# EAGLE schematic Hifi Nutube DAC (EAGLE 9.6.2)
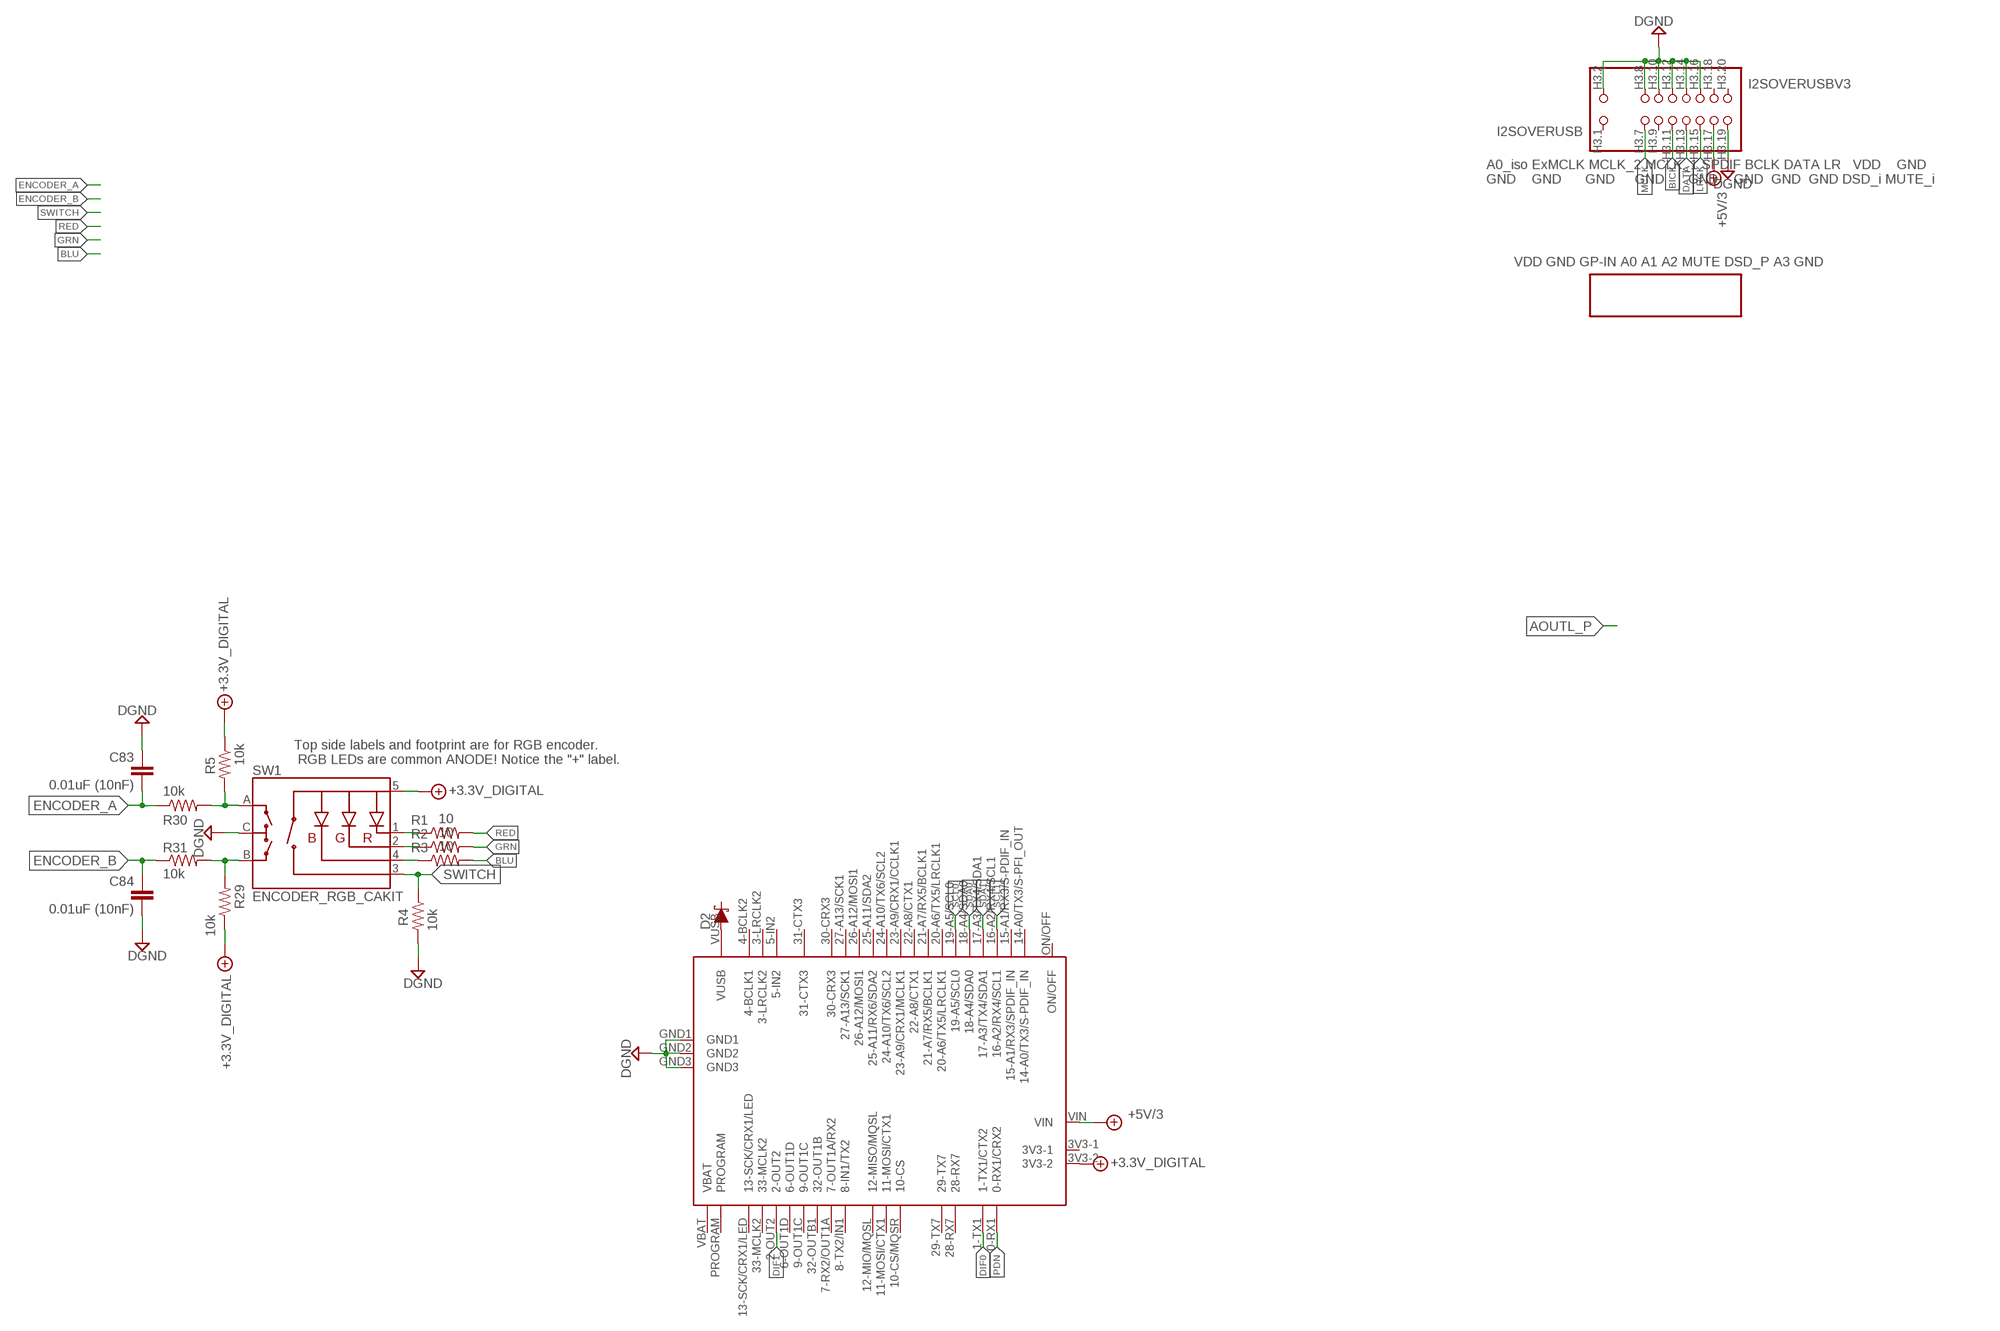
[diagram p0: schematic, sheet 1]

## Parts
C83  0.01uF (10nF)  C_885012206014_0603  [C0603]
C84  0.01uF (10nF)  C_885012206014_0603  [C0603]
D2  SS14-DIODE-SCHOTTKY-SS14  [SMA-DIODE]
I2SOVERUSB  I2SOVERUSBV3  [I2SOVERUSBV3]
R1  10  R_RC0603FR-7W10RL_0603  [R0603]
R2  10  R_RC0603FR-7W10RL_0603  [R0603]
R3  10  R_RC0603FR-7W10RL_0603  [R0603]
R4  10k  R_CMP0603AFX-1002ELF_0603  [R0603]
R5  10k  R_CMP0603AFX-1002ELF_0603  [R0603]
R29  10k  R_CMP0603AFX-1002ELF_0603  [R0603]
R30  10k  R_CMP0603AFX-1002ELF_0603  [R0603]
R31  10k  R_CMP0603AFX-1002ELF_0603  [R0603]
SW1  ENCODER_RGB_CAKIT  [ENCODER_LED_3_KIT]
U$4  TEENSY40  [TEENSY40]

## Nets
+3.3V_DIGITAL [Power]: R5.1 R29.1 SW1.5(+) U$4.3V3-2
+5V/3: I2SOVERUSB.H3.17 U$4.VIN
BICK: I2SOVERUSB.H3.11
BLU: R3.2
DATA: I2SOVERUSB.H3.13
DGND [Power]: C83.1 C84.2 I2SOVERUSB.H3.2 I2SOVERUSB.H3.8 I2SOVERUSB.H3.10 I2SOVERUSB.H3.12 I2SOVERUSB.H3.14 I2SOVERUSB.H3.16 I2SOVERUSB.H3.19 R4.2 SW1.C U$4.GND1 U$4.GND2 U$4.GND3
DIF0: U$4.1-TX1(1-TX1/CTX2)
DIF1: U$4.2-OUT2
ENCODER_A: C83.2 R30.1
ENCODER_B: C84.1 R31.1
GRN: R2.2
LRCK: I2SOVERUSB.H3.15
MCLK: I2SOVERUSB.H3.7
N$1: R1.1 SW1.1(-R)
N$4: R2.1 SW1.2(-G)
N$7: R3.1 SW1.4(-B)
N$9: R29.2 R31.2 SW1.B
N$10: R5.2 R30.2 SW1.A
N$14: D2.A U$4.VUSB
PDN: U$4.0-RX1(0-RX1/CRX2)
RED: R1.2
SCL0: U$4.19-A5/SCL0
SCL1: U$4.16-A2/RX4/SCL1
SDA0: U$4.18-A4/SDA0
SDA1: U$4.17-A3/TX4/SDA1
SWITCH: R4.1 SW1.3(SW)
Unconnected: D2.C I2SOVERUSB.H3.1 I2SOVERUSB.H3.9 I2SOVERUSB.H3.18 I2SOVERUSB.H3.20 U$4.3-LRCLK2 U$4.3V3-1 U$4.4-BCLK2(4-BCLK1) U$4.5-IN2 U$4.6-OUT1D U$4.7-RX2/OUT1A(7-OUT1A/RX2) U$4.8-TX2/IN1(8-IN1/TX2) U$4.9-OUT1C U$4.10-CS/MQSR(10-CS) U$4.11-MOSI/CTX1 U$4.12-MIO/MQSL(12-MISO/MQSL) U$4.13-SCK/CRX1/LED U$4.14-A0/TX3/S-PFI_OUT(14-A0/TX3/S-PDIF_IN) U$4.15-A1/RX3/S-PDIF_IN(15-A1/RX3/SPDIF_IN) U$4.20-A6/TX5/LRCLK1 U$4.21-A7/RX5/BCLK1 U$4.22-A8/CTX1 U$4.23-A9/CRX1/CCLK1(23-A9/CRX1/MCLK1) U$4.24-A10/TX6/SCL2 U$4.25-A11/SDA2(25-A11/RX6/SDA2) U$4.26-A12/MOSI1 U$4.27-A13/SCK1 U$4.28-RX7 U$4.29-TX7 U$4.30-CRX3 U$4.31-CTX3 U$4.32-OUTB1(32-OUT1B) U$4.33-MCLK2 U$4.ON/OFF U$4.PROGRAM U$4.VBAT

## Notes on the sheet
- Top side labels and footprint are for RGB encoder.
   RGB LEDs are common ANODE! Notice the "+" label.

## Library data of the parts
C83 C84 = Hifi Nutube DAC (Next 6) 28:C_: Non-Polarized CAPACITOR; BOM: Yes; DESCRIPTION: Multilayer Ceramic Capacitors MLCC - SMD/SMT WCAP-CSGP 0.01uF 0603 10% 10V MLCC; DISTRIBUTOR_PART_NUMBER: 710-885012206014; HEIGHT: 0.8mm; LINK: https://www.mouser.com/ProductDetail/Wurth-Elektronik/885012206014?qs=0KOYDY2FL2%252BG40IIH78uMA%3D%3D; MANUFACTURER_NAME: Wurth Elektronik; MANUFACTURER_PART_NUMBER: 885012206014
D2 = Hifi Nutube DAC (Next 6) 28:SS14-DIODE-SCHOTTKY: SS14 Schottky Diode; BOM: Yes; DESCRIPTION: Schottky Diodes & Rectifiers PJ/SS14/TR/7"/HF/1.8K/SMA/SKY/SMD/SSM-10AH/SSM10-QI11/PJ///; DISTRIBUTOR_PART_NUMBER: 241-SS14_R1_00001; HEIGHT: 2.44mm; LINK: https://www.mouser.com/ProductDetail/Panjit/SS14_R1_00001?qs=sPbYRqrBIVlid9xBt7d0Dw%3D%3D; MANUFACTURER_NAME: Panjit; MANUFACTURER_PART_NUMBER: SS14_R1_00001
I2SOVERUSB = Hifi Nutube DAC (Next 6) 28:I2SOVERUSBV3: Asynchronous audio transfer at sampling rates up to 768 kHz and 32 bit; BOM: Yes; DESCRIPTION: Asynchronous audio transfer at sampling rates up to 768 kHz and 32 bit
R1-R3 = Hifi Nutube DAC (Next 6) 28:R_: Thick Film RESISTOR; BOM: Yes; DESCRIPTION: Thick Film Resistors - SMD 10 Ohms 200 mW 0603 1%; DISTRIBUTOR_PART_NUMBER: 603-RC0603FR-7W10RL; HEIGHT: 0.45mm; LINK: https://www.mouser.com/ProductDetail/YAGEO/RC0603FR-7W10RL?qs=sGAEpiMZZMtlubZbdhIBINhe0vL5TjR%2FTE8bL4OlmcM%3D; MANUFACTURER_NAME: YAGEO; MANUFACTURER_PART_NUMBER: RC0603FR-7W10RL
R4 R5 R29-R31 = Hifi Nutube DAC (Next 6) 28:R_: Thick Film RESISTOR; BOM: Yes; DESCRIPTION: Thick Film Resistors - SMD 10K OHM 1% 1/4W TC100; DISTRIBUTOR_PART_NUMBER: 652-CMP0603AFX-1002L; HEIGHT: 0.45mm; LINK: https://www.mouser.com/ProductDetail/Bourns/CMP0603AFX-1002ELF?qs=%2Fha2pyFaduhorRtoKKmEbo5q%2F6upGdOUhUshNcvz2ZoEikVHWlJpryKxivczBxfl; MANUFACTURER_NAME: Bourns; MANUFACTURER_PART_NUMBER: CMP0603AFX-1002ELF
SW1 = Hifi Nutube DAC (Next 6) 28:ENCODER_RGB_CA: Illuminated Rotary Encoder w/ RGB LED and select switch EC12PLRGBSDVBF-D: http://top-up.so-buy.com/front/bin/ptdetail.phtml?Part=EC12PLRGBSDVBF-D; BOM: Yes; DESCRIPTION: Illuminated Rotary Encoder w/ RGB LED and select switch
U$4 = teensy:TEENSY40: Teensy 4.0 device including POGO pins for pins 24 - 33, but not yet pins for D+ and D-. Symbol layout is what works for me and may not suite everyone... that can be added or additional symbols can be created to be used in a modilied davie name.

## Net classes
0 default: width 0.246 mm, drill 0.246 mm, clearance 0.254 mm
1 diff pairs: width 0.246 mm, drill 0.246 mm, clearance 0.254 mm
3 Power: width 1.27 mm, drill 1.27 mm, clearance 0.254 mm